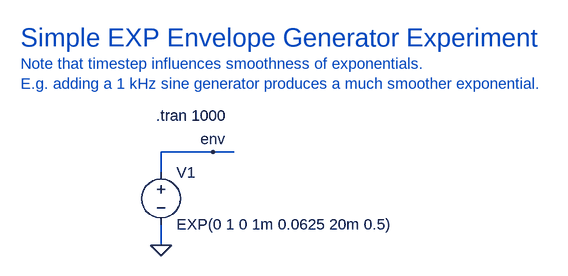
[diagram p0: schematic env_gen2.asc]
env_gen2.asc, the LTspice schematic file:
Version 4
SHEET 1 1536 820
WIRE -1088 -112 -1168 -112
WIRE -1056 -112 -1088 -112
WIRE -1168 -80 -1168 -112
WIRE -1168 32 -1168 0
FLAG -1168 32 0
FLAG -1088 -112 env
SYMBOL voltage -1168 -96 R0
WINDOW 123 0 0 Left 0
WINDOW 39 0 0 Left 0
SYMATTR InstName V1
SYMATTR Value EXP(0 1 0 1m 0.0625 20m 0.5)
TEXT -1176 -168 Left 2 !.tran 1000
TEXT -1384 -288 Left 4 ;Simple EXP Envelope Generator Experiment
TEXT -1384 -248 Left 2 ;Note that timestep influences smoothness of exponentials.\nE.g. adding a 1 kHz sine generator produces a much smoother exponential.

The netlist it stands for:
* env_gen2.asc
V1 env 0 EXP(0 1 0 1m 0.0625 20m 0.5)
.tran 1000
* Simple EXP Envelope Generator Experiment
* Note that timestep influences smoothness of exponentials.
* E.g. adding a 1 kHz sine generator produces a much smoother exponential.
.backanno
.end